# EAGLE schematic ISA Sound Card (EAGLE 9.0.1)

## Sheet 1 of 4: ISA buffers
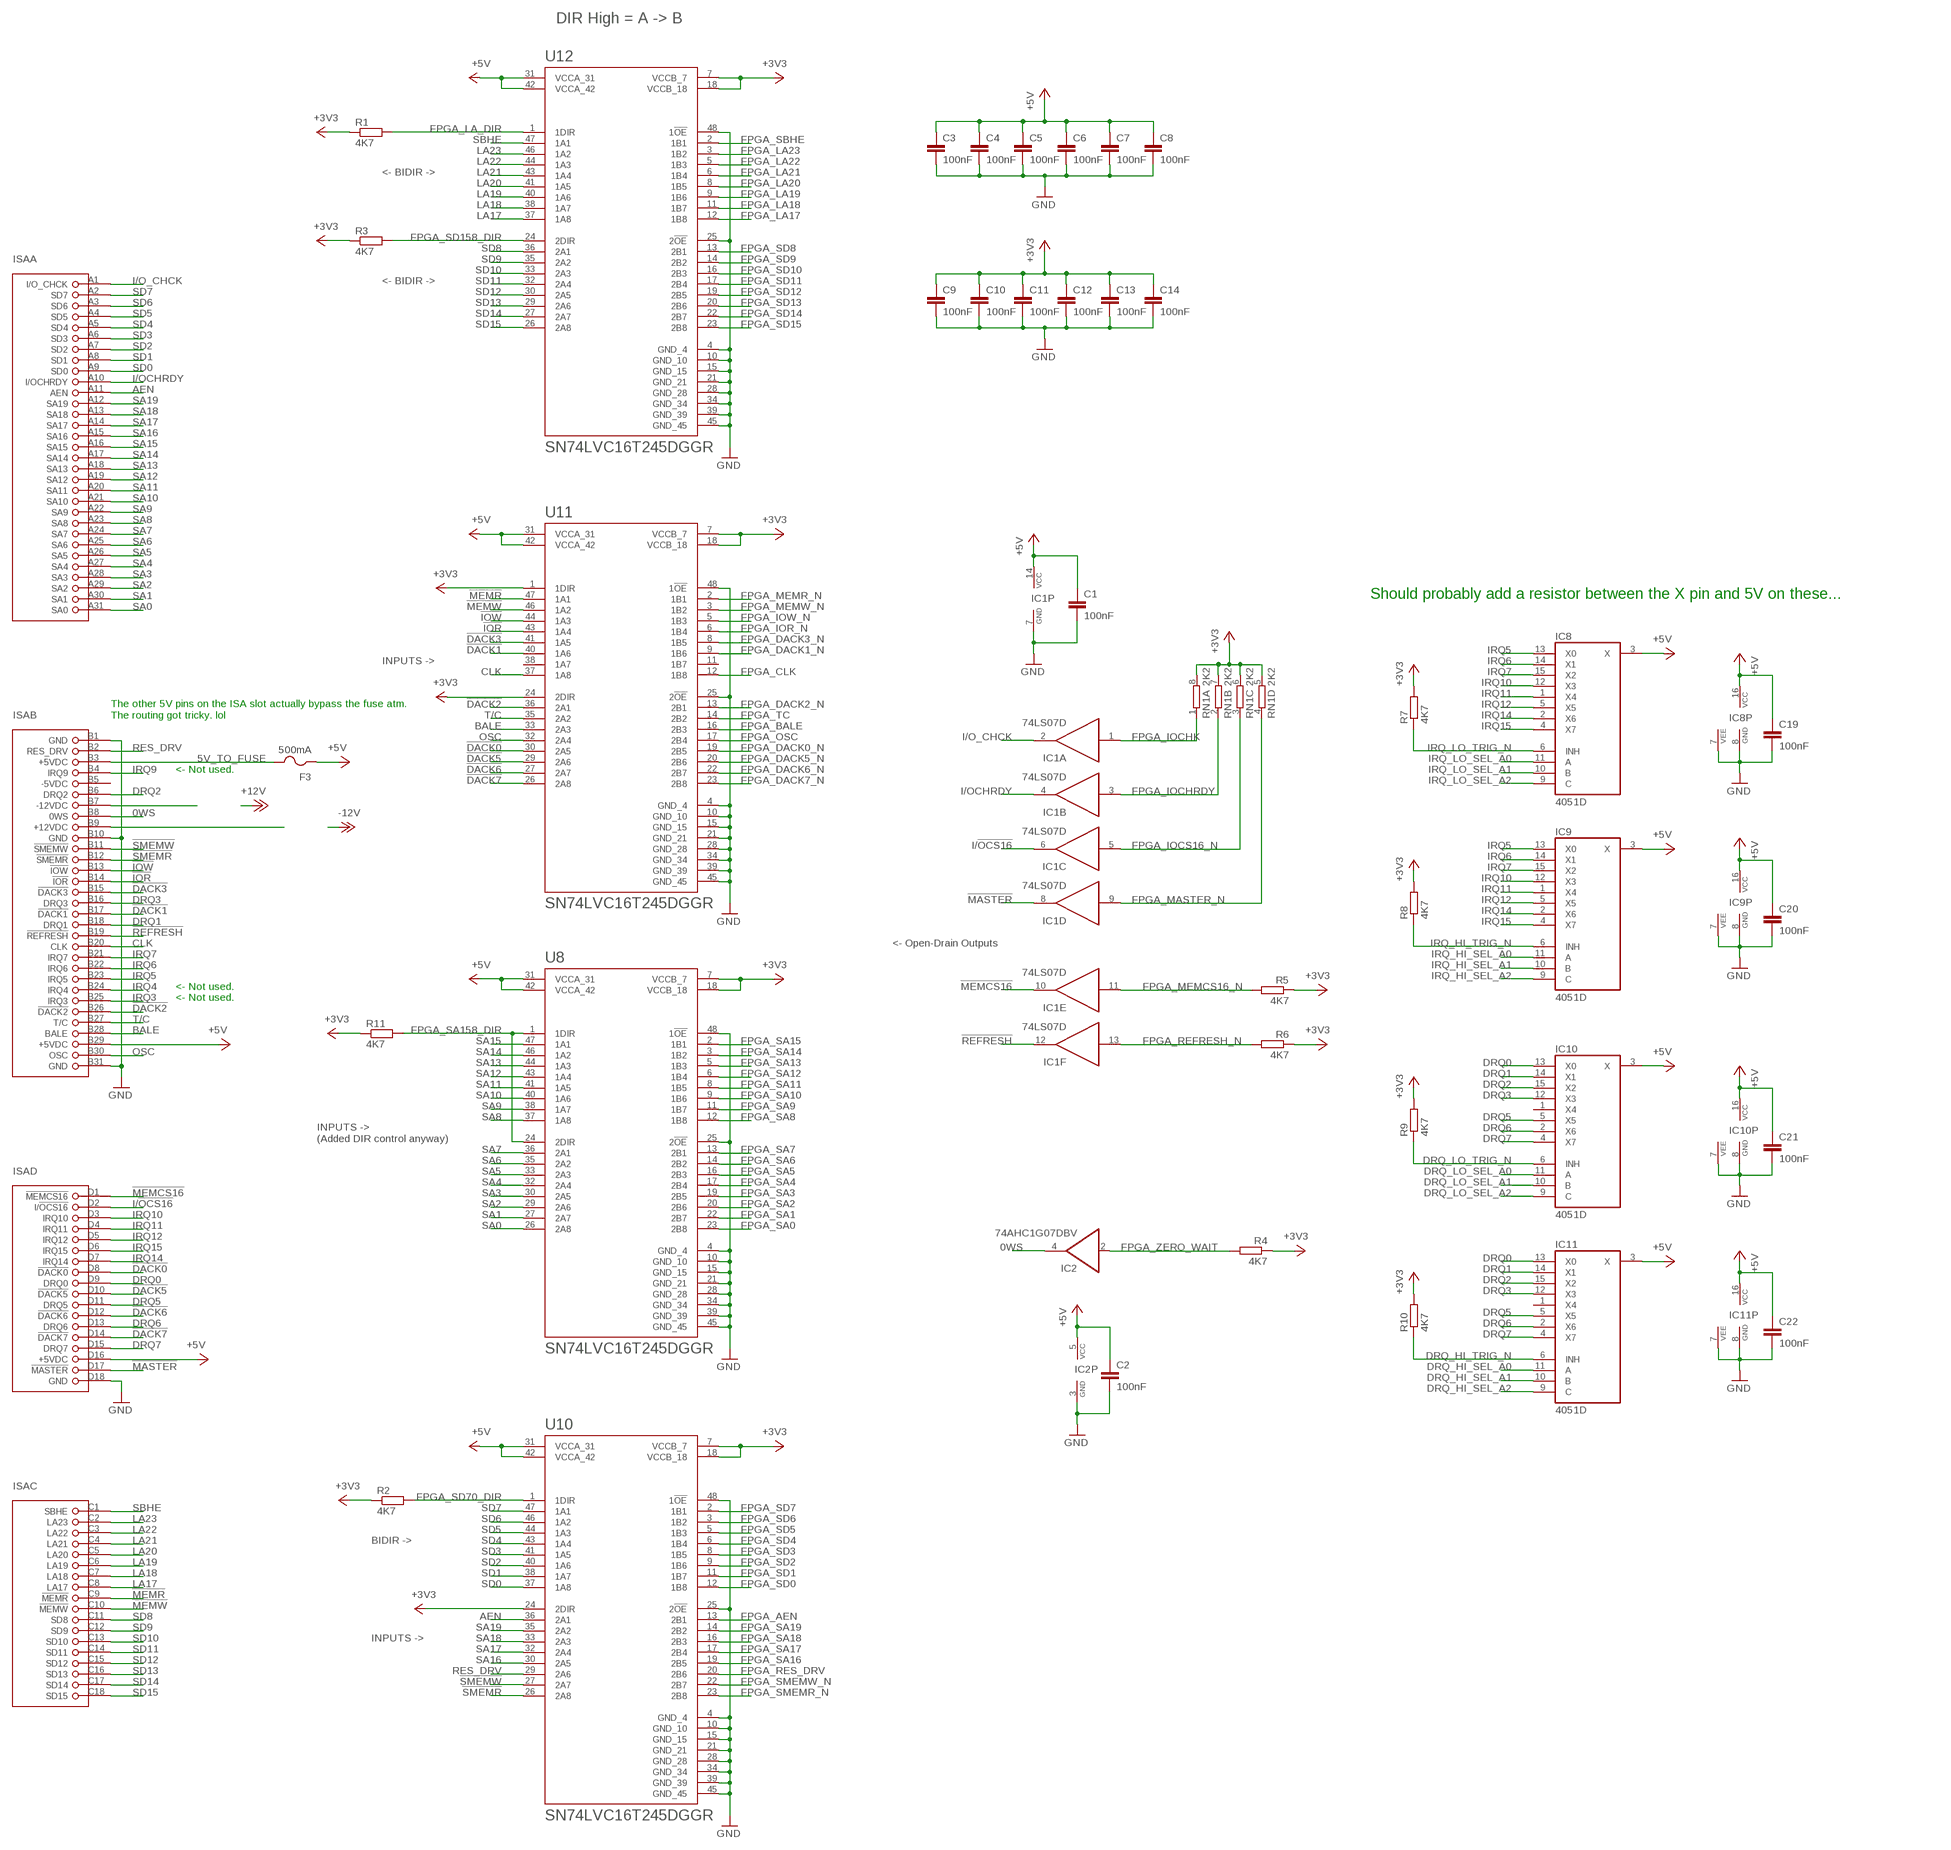
[diagram p0: schematic, sheet 1]

### Parts
C1  100nF  C-EUC0603  [C0603]
C2  100nF  C-EUC0603  [C0603]
C3  100nF  C-EUC0603  [C0603]
C4  100nF  C-EUC0603  [C0603]
C5  100nF  C-EUC0603  [C0603]
C6  100nF  C-EUC0603  [C0603]
C7  100nF  C-EUC0603  [C0603]
C8  100nF  C-EUC0603  [C0603]
C9  100nF  C-EUC0603  [C0603]
C10  100nF  C-EUC0603  [C0603]
C11  100nF  C-EUC0603  [C0603]
C12  100nF  C-EUC0603  [C0603]
C13  100nF  C-EUC0603  [C0603]
C14  100nF  C-EUC0603  [C0603]
C19  100nF  C-EUC0603  [C0603]
C20  100nF  C-EUC0603  [C0603]
C21  100nF  C-EUC0603  [C0603]
C22  100nF  C-EUC0603  [C0603]
F3  500mA  PTCFUSE-1206  [R1206]
IC1  74LS07D  [SO14]
IC2  74AHC1G07DBV  [SOT23-5]
IC8  4051D  [SO16]
IC9  4051D  [SO16]
IC10  4051D  [SO16]
IC11  4051D  [SO16]
ISA  IBMATBUS  [IBM-AT]
R1  4K7  R-EU_R0603  [R0603]
R2  4K7  R-EU_R0603  [R0603]
R3  4K7  R-EU_R0603  [R0603]
R4  4K7  R-EU_R0603  [R0603]
R5  4K7  R-EU_R0603  [R0603]
R6  4K7  R-EU_R0603  [R0603]
R7  4K7  R-EU_R0603  [R0603]
R8  4K7  R-EU_R0603  [R0603]
R9  4K7  R-EU_R0603  [R0603]
R10  4K7  R-EU_R0603  [R0603]
R11  4K7  R-EU_R0603  [R0603]
RN1  2K2  4R-N0603-ARC  [0603-ARC]
U8  SN74LVC16T245DGGR  [SOP50P810X120-48N]
U10  SN74LVC16T245DGGR  [SOP50P810X120-48N]
U11  SN74LVC16T245DGGR  [SOP50P810X120-48N]
U12  SN74LVC16T245DGGR  [SOP50P810X120-48N]

### Nets
0WS: IC2.4(O) ISA.B8(B:0WS)
5V_TO_FUSE: F3.2 ISA.B3(B:+5VDC)
!DACK0: ISA.D8(D:!DACK0) U11.30(2A5)
!DACK1: ISA.B17(B:!DACK1) U11.40(1A6)
!DACK2: ISA.B26(B:!DACK2) U11.36(2A1)
!DACK3: ISA.B15(B:!DACK3) U11.41(1A5)
!DACK5: ISA.D10(D:!DACK5) U11.29(2A6)
!DACK6: ISA.D12(D:!DACK6) U11.27(2A7)
!DACK7: ISA.D14(D:!DACK7) U11.26(2A8)
!IOR: ISA.B14(B:!IOR) U11.43(1A4)
!IOW: ISA.B13(B:!IOW) U11.44(1A3)
!MASTER: IC1.8(D:O) ISA.D17(D:!MASTER)
!MEMCS16: IC1.10(E:O) ISA.D1(D:!MEMCS16)
!MEMR: ISA.C9(C:!MEMR) U11.47(1A1)
!MEMW: ISA.C10(C:!MEMW) U11.46(1A2)
!REFRESH: IC1.12(F:O) ISA.B19(B:!REFRESH)
!SMEMR: ISA.B12(B:!SMEMR) U10.26(2A8)
!SMEMW: ISA.B11(B:!SMEMW) U10.27(2A7)
+3V3: C9.1 C10.1 C11.1 C12.1 C13.1 C14.1 R1.1 R2.1 R3.1 R4.1 R5.1 R6.1 R7.2 R8.2 R9.2 R10.2 R11.1 RN1.5 RN1.6 RN1.7 RN1.8 U8.7(VCCB_7) U8.18(VCCB_18) U10.7(VCCB_7) U10.18(VCCB_18) U10.24(2DIR) U11.1(1DIR) U11.7(VCCB_7) U11.18(VCCB_18) U11.24(2DIR) U12.7(VCCB_7) U12.18(VCCB_18) ; also sheet 2,4
+5V: C1.1 C2.1 C3.1 C4.1 C5.1 C6.1 C7.1 C8.1 C19.1 C20.1 C21.1 C22.1 F3.1 IC1.14(P:VCC) IC2.5(VCC) IC8.3(X) IC8.16(VCC) IC9.3(X) IC9.16(VCC) IC10.3(X) IC10.16(VCC) IC11.3(X) IC11.16(VCC) ISA.B29(B:+5VDC) ISA.D16(D:+5VDC) U8.31(VCCA_31) U8.42(VCCA_42) U10.31(VCCA_31) U10.42(VCCA_42) U11.31(VCCA_31) U11.42(VCCA_42) U12.31(VCCA_31) U12.42(VCCA_42) ; also sheet 2,3,4
AEN: ISA.A11(A:AEN) U10.36(2A1)
BALE: ISA.B28(B:BALE) U11.33(2A3)
CLK: ISA.B20(B:CLK) U11.37(1A8)
DRQ0: IC10.13(X0) IC11.13(X0) ISA.D9(D:DRQ0)
DRQ1: IC10.14(X1) IC11.14(X1) ISA.B18(B:DRQ1)
DRQ2: IC10.15(X2) IC11.15(X2) ISA.B6(B:DRQ2)
DRQ3: IC10.12(X3) IC11.12(X3) ISA.B16(B:DRQ3)
DRQ5: IC10.5(X5) IC11.5(X5) ISA.D11(D:DRQ5)
DRQ6: IC10.2(X6) IC11.2(X6) ISA.D13(D:DRQ6)
DRQ7: IC10.4(X7) IC11.4(X7) ISA.D15(D:DRQ7)
DRQ_HI_SEL_A0: IC11.11(A) ; also sheet 2
DRQ_HI_SEL_A1: IC11.10(B) ; also sheet 2
DRQ_HI_SEL_A2: IC11.9(C) ; also sheet 2
DRQ_HI_TRIG_N: IC11.6(INH) R10.1 ; also sheet 2
DRQ_LO_SEL_A0: IC10.11(A) ; also sheet 2
DRQ_LO_SEL_A1: IC10.10(B) ; also sheet 2
DRQ_LO_SEL_A2: IC10.9(C) ; also sheet 2
DRQ_LO_TRIG_N: IC10.6(INH) R9.1 ; also sheet 2
FPGA_AEN: U10.13(2B1) ; also sheet 2
FPGA_BALE: U11.16(2B3) ; also sheet 2
FPGA_CLK: U11.12(1B8) ; also sheet 2
FPGA_DACK0_N: U11.19(2B5) ; also sheet 2
FPGA_DACK1_N: U11.9(1B6) ; also sheet 2
FPGA_DACK2_N: U11.13(2B1) ; also sheet 2
FPGA_DACK3_N: U11.8(1B5) ; also sheet 2
FPGA_DACK5_N: U11.20(2B6) ; also sheet 2
FPGA_DACK6_N: U11.22(2B7) ; also sheet 2
FPGA_DACK7_N: U11.23(2B8) ; also sheet 2
FPGA_IOCHK: IC1.1(A:I) RN1.1 ; also sheet 2
FPGA_IOCHRDY: IC1.3(B:I) RN1.2 ; also sheet 2
FPGA_IOCS16_N: IC1.5(C:I) RN1.3 ; also sheet 2
FPGA_IOR_N: U11.6(1B4) ; also sheet 2
FPGA_IOW_N: U11.5(1B3) ; also sheet 2
FPGA_LA17: U12.12(1B8) ; also sheet 2
FPGA_LA18: U12.11(1B7) ; also sheet 2
FPGA_LA19: U12.9(1B6) ; also sheet 2
FPGA_LA20: U12.8(1B5) ; also sheet 2
FPGA_LA21: U12.6(1B4) ; also sheet 2
FPGA_LA22: U12.5(1B3) ; also sheet 2
FPGA_LA23: U12.3(1B2) ; also sheet 2
FPGA_LA_DIR: R1.2 U12.1(1DIR) ; also sheet 2
FPGA_MASTER_N: IC1.9(D:I) RN1.4 ; also sheet 2
FPGA_MEMCS16_N: IC1.11(E:I) R5.2 ; also sheet 2
FPGA_MEMR_N: U11.2(1B1) ; also sheet 2
FPGA_MEMW_N: U11.3(1B2) ; also sheet 2
FPGA_OSC: U11.17(2B4) ; also sheet 2
FPGA_REFRESH_N: IC1.13(F:I) R6.2 ; also sheet 2
FPGA_RES_DRV: U10.20(2B6) ; also sheet 2
FPGA_SA0: U8.23(2B8) ; also sheet 2
FPGA_SA1: U8.22(2B7) ; also sheet 2
FPGA_SA2: U8.20(2B6) ; also sheet 2
FPGA_SA3: U8.19(2B5) ; also sheet 2
FPGA_SA4: U8.17(2B4) ; also sheet 2
FPGA_SA5: U8.16(2B3) ; also sheet 2
FPGA_SA6: U8.14(2B2) ; also sheet 2
FPGA_SA7: U8.13(2B1) ; also sheet 2
FPGA_SA8: U8.12(1B8) ; also sheet 2
FPGA_SA9: U8.11(1B7) ; also sheet 2
FPGA_SA10: U8.9(1B6) ; also sheet 2
FPGA_SA11: U8.8(1B5) ; also sheet 2
FPGA_SA12: U8.6(1B4) ; also sheet 2
FPGA_SA13: U8.5(1B3) ; also sheet 2
FPGA_SA14: U8.3(1B2) ; also sheet 2
FPGA_SA15: U8.2(1B1) ; also sheet 2
FPGA_SA16: U10.19(2B5) ; also sheet 2
FPGA_SA17: U10.17(2B4) ; also sheet 2
FPGA_SA18: U10.16(2B3) ; also sheet 2
FPGA_SA19: U10.14(2B2) ; also sheet 2
FPGA_SA158_DIR: R11.2 U8.1(1DIR) U8.24(2DIR) ; also sheet 2
FPGA_SBHE: U12.2(1B1) ; also sheet 2
FPGA_SD0: U10.12(1B8) ; also sheet 2
FPGA_SD1: U10.11(1B7) ; also sheet 2
FPGA_SD2: U10.9(1B6) ; also sheet 2
FPGA_SD3: U10.8(1B5) ; also sheet 2
FPGA_SD4: U10.6(1B4) ; also sheet 2
FPGA_SD5: U10.5(1B3) ; also sheet 2
FPGA_SD6: U10.3(1B2) ; also sheet 2
FPGA_SD7: U10.2(1B1) ; also sheet 2
FPGA_SD8: U12.13(2B1) ; also sheet 2
FPGA_SD9: U12.14(2B2) ; also sheet 2
FPGA_SD10: U12.16(2B3) ; also sheet 2
FPGA_SD11: U12.17(2B4) ; also sheet 2
FPGA_SD12: U12.19(2B5) ; also sheet 2
FPGA_SD13: U12.20(2B6) ; also sheet 2
FPGA_SD14: U12.22(2B7) ; also sheet 2
FPGA_SD15: U12.23(2B8) ; also sheet 2
FPGA_SD70_DIR: R2.2 U10.1(1DIR) ; also sheet 2
FPGA_SD158_DIR: R3.2 U12.24(2DIR) ; also sheet 2
FPGA_SMEMR_N: U10.23(2B8) ; also sheet 2
FPGA_SMEMW_N: U10.22(2B7) ; also sheet 2
FPGA_TC: U11.14(2B2) ; also sheet 2
FPGA_ZERO_WAIT: IC2.2(I) R4.2 ; also sheet 2
GND: C1.2 C2.2 C3.2 C4.2 C5.2 C6.2 C7.2 C8.2 C9.2 C10.2 C11.2 C12.2 C13.2 C14.2 C19.2 C20.2 C21.2 C22.2 IC1.7(P:GND) IC2.3(GND) IC8.7(VEE) IC8.8(GND) IC9.7(VEE) IC9.8(GND) IC10.7(VEE) IC10.8(GND) IC11.7(VEE) IC11.8(GND) ISA.B1(B:GND) ISA.B10(B:GND) ISA.B31(B:GND) ISA.D18(D:GND) U8.4(GND_4) U8.10(GND_10) U8.15(GND_15) U8.21(GND_21) U8.25(2!OE) U8.28(GND_28) U8.34(GND_34) U8.39(GND_39) U8.45(GND_45) U8.48(1!OE) U10.4(GND_4) U10.10(GND_10) U10.15(GND_15) U10.21(GND_21) U10.25(2!OE) U10.28(GND_28) U10.34(GND_34) U10.39(GND_39) U10.45(GND_45) U10.48(1!OE) U11.4(GND_4) U11.10(GND_10) U11.15(GND_15) U11.21(GND_21) U11.25(2!OE) U11.28(GND_28) U11.34(GND_34) U11.39(GND_39) U11.45(GND_45) U11.48(1!OE) U12.4(GND_4) U12.10(GND_10) U12.15(GND_15) U12.21(GND_21) U12.25(2!OE) U12.28(GND_28) U12.34(GND_34) U12.39(GND_39) U12.45(GND_45) U12.48(1!OE) ; also sheet 2,3,4
I/!OCS16: IC1.6(C:O) ISA.D2(D:I/!OCS16)
I/O_CHCK: IC1.2(A:O) ISA.A1(A:I/O_CHCK)
I/OCHRDY: IC1.4(B:O) ISA.A10(A:I/OCHRDY)
IRQ3: ISA.B25(B:IRQ3)
IRQ4: ISA.B24(B:IRQ4)
IRQ5: IC8.13(X0) IC9.13(X0) ISA.B23(B:IRQ5)
IRQ6: IC8.14(X1) IC9.14(X1) ISA.B22(B:IRQ6)
IRQ7: IC8.15(X2) IC9.15(X2) ISA.B21(B:IRQ7)
IRQ9: ISA.B4(B:IRQ9)
IRQ10: IC8.12(X3) IC9.12(X3) ISA.D3(D:IRQ10)
IRQ11: IC8.1(X4) IC9.1(X4) ISA.D4(D:IRQ11)
IRQ12: IC8.5(X5) IC9.5(X5) ISA.D5(D:IRQ12)
IRQ14: IC8.2(X6) IC9.2(X6) ISA.D7(D:IRQ14)
IRQ15: IC8.4(X7) IC9.4(X7) ISA.D6(D:IRQ15)
IRQ_HI_SEL_A0: IC9.11(A) ; also sheet 2
IRQ_HI_SEL_A1: IC9.10(B) ; also sheet 2
IRQ_HI_SEL_A2: IC9.9(C) ; also sheet 2
IRQ_HI_TRIG_N: IC9.6(INH) R8.1 ; also sheet 2
IRQ_LO_SEL_A0: IC8.11(A) ; also sheet 2
IRQ_LO_SEL_A1: IC8.10(B) ; also sheet 2
IRQ_LO_SEL_A2: IC8.9(C) ; also sheet 2
IRQ_LO_TRIG_N: IC8.6(INH) R7.1 ; also sheet 2
LA17: ISA.C8(C:LA17) U12.37(1A8)
LA18: ISA.C7(C:LA18) U12.38(1A7)
LA19: ISA.C6(C:LA19) U12.40(1A6)
LA20: ISA.C5(C:LA20) U12.41(1A5)
LA21: ISA.C4(C:LA21) U12.43(1A4)
LA22: ISA.C3(C:LA22) U12.44(1A3)
LA23: ISA.C2(C:LA23) U12.46(1A2)
N$14: ISA.B7(B:-12VDC)
N$27: ISA.B9(B:+12VDC)
OSC: ISA.B30(B:OSC) U11.32(2A4)
RES_DRV: ISA.B2(B:RES_DRV) U10.29(2A6)
SA0: ISA.A31(A:SA0) U8.26(2A8)
SA1: ISA.A30(A:SA1) U8.27(2A7)
SA2: ISA.A29(A:SA2) U8.29(2A6)
SA3: ISA.A28(A:SA3) U8.30(2A5)
SA4: ISA.A27(A:SA4) U8.32(2A4)
SA5: ISA.A26(A:SA5) U8.33(2A3)
SA6: ISA.A25(A:SA6) U8.35(2A2)
SA7: ISA.A24(A:SA7) U8.36(2A1)
SA8: ISA.A23(A:SA8) U8.37(1A8)
SA9: ISA.A22(A:SA9) U8.38(1A7)
SA10: ISA.A21(A:SA10) U8.40(1A6)
SA11: ISA.A20(A:SA11) U8.41(1A5)
SA12: ISA.A19(A:SA12) U8.43(1A4)
SA13: ISA.A18(A:SA13) U8.44(1A3)
SA14: ISA.A17(A:SA14) U8.46(1A2)
SA15: ISA.A16(A:SA15) U8.47(1A1)
SA16: ISA.A15(A:SA16) U10.30(2A5)
SA17: ISA.A14(A:SA17) U10.32(2A4)
SA18: ISA.A13(A:SA18) U10.33(2A3)
SA19: ISA.A12(A:SA19) U10.35(2A2)
SBHE: ISA.C1(C:SBHE) U12.47(1A1)
SD0: ISA.A9(A:SD0) U10.37(1A8)
SD1: ISA.A8(A:SD1) U10.38(1A7)
SD2: ISA.A7(A:SD2) U10.40(1A6)
SD3: ISA.A6(A:SD3) U10.41(1A5)
SD4: ISA.A5(A:SD4) U10.43(1A4)
SD5: ISA.A4(A:SD5) U10.44(1A3)
SD6: ISA.A3(A:SD6) U10.46(1A2)
SD7: ISA.A2(A:SD7) U10.47(1A1)
SD8: ISA.C11(C:SD8) U12.36(2A1)
SD9: ISA.C12(C:SD9) U12.35(2A2)
SD10: ISA.C13(C:SD10) U12.33(2A3)
SD11: ISA.C14(C:SD11) U12.32(2A4)
SD12: ISA.C15(C:SD12) U12.30(2A5)
SD13: ISA.C16(C:SD13) U12.29(2A6)
SD14: ISA.C17(C:SD14) U12.27(2A7)
SD15: ISA.C18(C:SD15) U12.26(2A8)
T/C: ISA.B27(B:T/C) U11.35(2A2)
Unconnected: IC10.1(X4) IC11.1(X4) U11.11(1B7) U11.38(1A7)

### Notes on the sheet
- DIR High = A -> B
- <- BIDIR ->
- <- BIDIR ->
- Should probably add a resistor between the X pin and 5V on these...
- INPUTS ->
- The other 5V pins on the ISA slot actually bypass the fuse atm.
  The routing got tricky. lol
- <- Not used.
- <- Open-Drain Outputs
- <- Not used.
- <- Not used.
- INPUTS ->
  (Added DIR control anyway)
- BIDIR ->
- INPUTS ->

## Sheet 2 of 4: FPGA
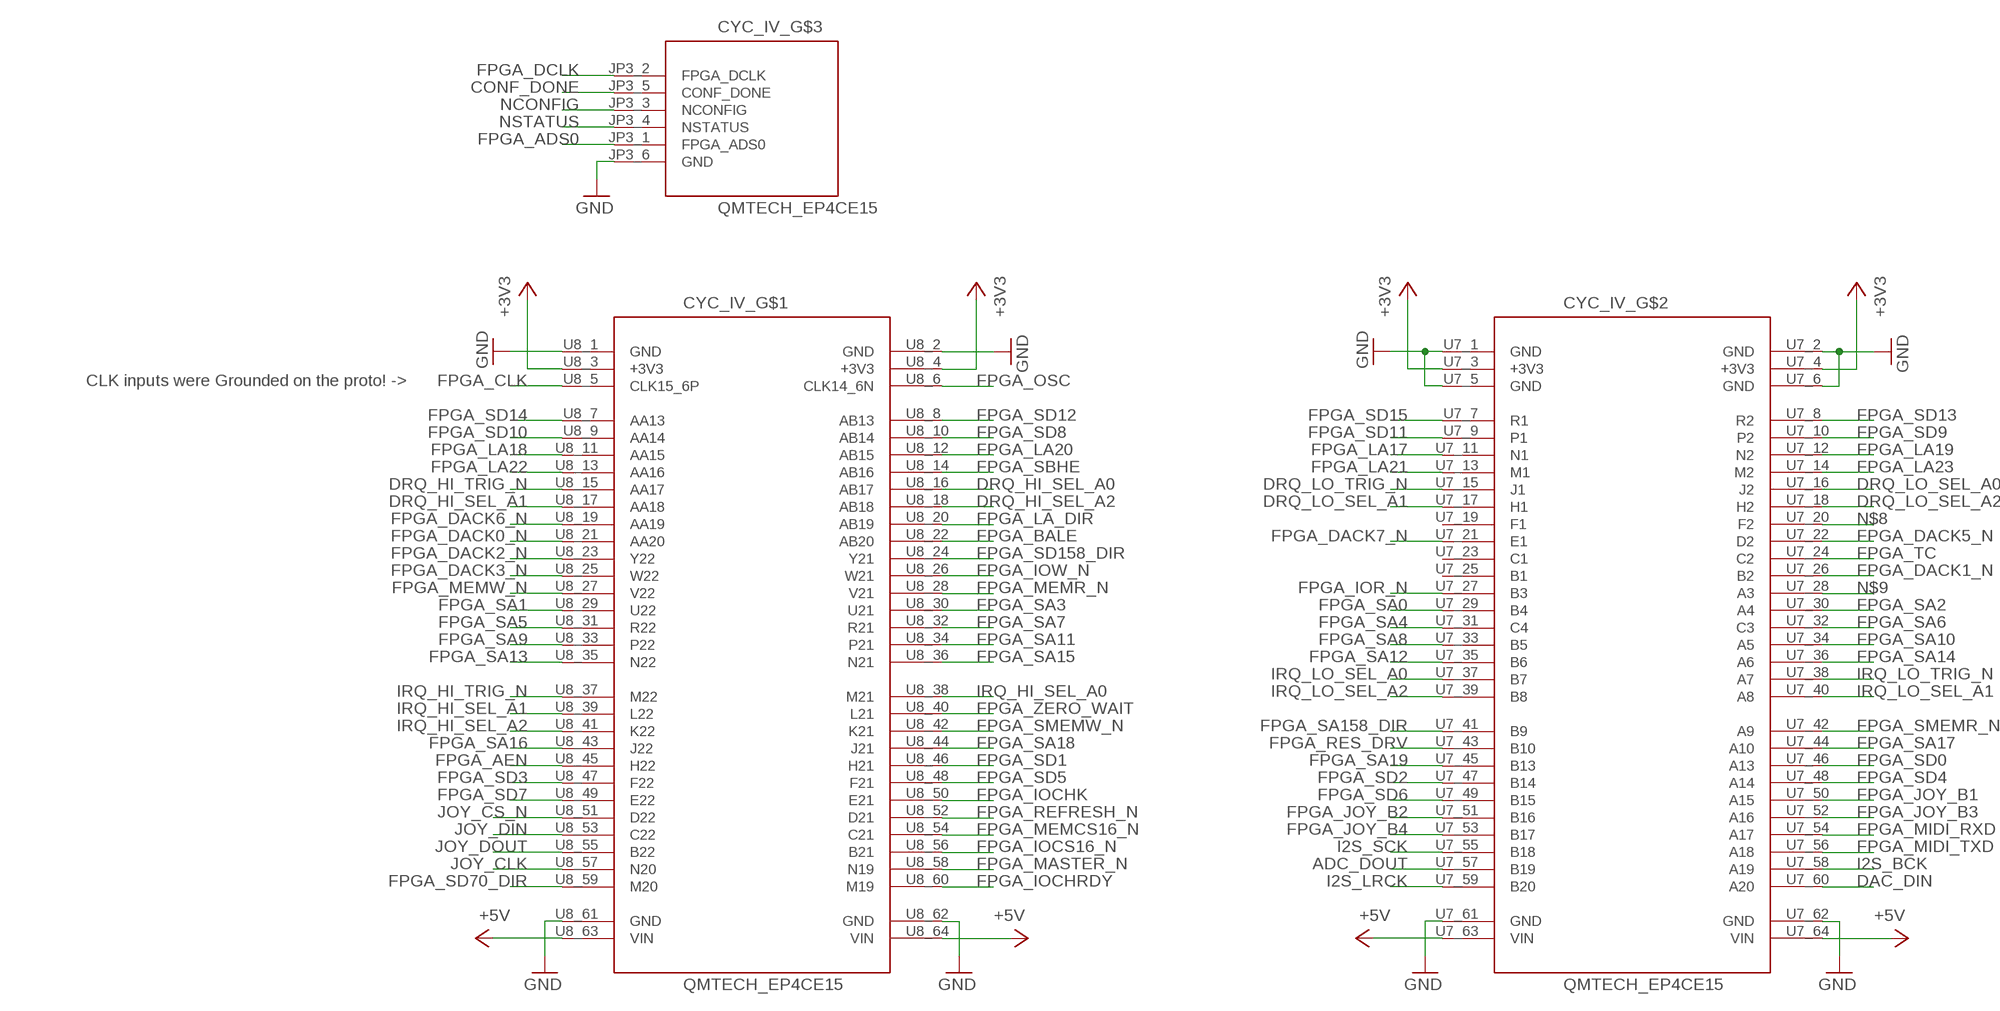
[diagram p1: schematic, sheet 2]

### Parts
CYC_IV_  QMTECH_EP4CE15  [QMTECH_EP4CE15_SMD]

### Nets
+3V3: CYC_IV_.U7_3(+3V3) CYC_IV_.U7_4(+3V3) CYC_IV_.U8_3(+3V3) CYC_IV_.U8_4(+3V3) ; also sheet 1,4
+5V: CYC_IV_.U7_63(VIN) CYC_IV_.U7_64(VIN) CYC_IV_.U8_63(VIN) CYC_IV_.U8_64(VIN) ; also sheet 1,3,4
ADC_DOUT: CYC_IV_.U7_57(B19) ; also sheet 3
CONF_DONE: CYC_IV_.JP3_5(CONF_DONE)
DAC_DIN: CYC_IV_.U7_60(A20) ; also sheet 3
DRQ_HI_SEL_A0: CYC_IV_.U8_16(AB17) ; also sheet 1
DRQ_HI_SEL_A1: CYC_IV_.U8_17(AA18) ; also sheet 1
DRQ_HI_SEL_A2: CYC_IV_.U8_18(AB18) ; also sheet 1
DRQ_HI_TRIG_N: CYC_IV_.U8_15(AA17) ; also sheet 1
DRQ_LO_SEL_A0: CYC_IV_.U7_16(J2) ; also sheet 1
DRQ_LO_SEL_A1: CYC_IV_.U7_17(H1) ; also sheet 1
DRQ_LO_SEL_A2: CYC_IV_.U7_18(H2) ; also sheet 1
DRQ_LO_TRIG_N: CYC_IV_.U7_15(J1) ; also sheet 1
FPGA_ADS0: CYC_IV_.JP3_1(FPGA_ADS0)
FPGA_AEN: CYC_IV_.U8_45(H22) ; also sheet 1
FPGA_BALE: CYC_IV_.U8_22(AB20) ; also sheet 1
FPGA_CLK: CYC_IV_.U8_5(CLK15_6P) ; also sheet 1
FPGA_DACK0_N: CYC_IV_.U8_21(AA20) ; also sheet 1
FPGA_DACK1_N: CYC_IV_.U7_26(B2) ; also sheet 1
FPGA_DACK2_N: CYC_IV_.U8_23(Y22) ; also sheet 1
FPGA_DACK3_N: CYC_IV_.U8_25(W22) ; also sheet 1
FPGA_DACK5_N: CYC_IV_.U7_22(D2) ; also sheet 1
FPGA_DACK6_N: CYC_IV_.U8_19(AA19) ; also sheet 1
FPGA_DACK7_N: CYC_IV_.U7_21(E1) ; also sheet 1
FPGA_DCLK: CYC_IV_.JP3_2(FPGA_DCLK)
FPGA_IOCHK: CYC_IV_.U8_50(E21) ; also sheet 1
FPGA_IOCHRDY: CYC_IV_.U8_60(M19) ; also sheet 1
FPGA_IOCS16_N: CYC_IV_.U8_56(B21) ; also sheet 1
FPGA_IOR_N: CYC_IV_.U7_27(B3) ; also sheet 1
FPGA_IOW_N: CYC_IV_.U8_26(W21) ; also sheet 1
FPGA_JOY_B1: CYC_IV_.U7_50(A15) ; also sheet 4
FPGA_JOY_B2: CYC_IV_.U7_51(B16) ; also sheet 4
FPGA_JOY_B3: CYC_IV_.U7_52(A16) ; also sheet 4
FPGA_JOY_B4: CYC_IV_.U7_53(B17) ; also sheet 4
FPGA_LA17: CYC_IV_.U7_11(N1) ; also sheet 1
FPGA_LA18: CYC_IV_.U8_11(AA15) ; also sheet 1
FPGA_LA19: CYC_IV_.U7_12(N2) ; also sheet 1
FPGA_LA20: CYC_IV_.U8_12(AB15) ; also sheet 1
FPGA_LA21: CYC_IV_.U7_13(M1) ; also sheet 1
FPGA_LA22: CYC_IV_.U8_13(AA16) ; also sheet 1
FPGA_LA23: CYC_IV_.U7_14(M2) ; also sheet 1
FPGA_LA_DIR: CYC_IV_.U8_20(AB19) ; also sheet 1
FPGA_MASTER_N: CYC_IV_.U8_58(N19) ; also sheet 1
FPGA_MEMCS16_N: CYC_IV_.U8_54(C21) ; also sheet 1
FPGA_MEMR_N: CYC_IV_.U8_28(V21) ; also sheet 1
FPGA_MEMW_N: CYC_IV_.U8_27(V22) ; also sheet 1
FPGA_MIDI_RXD: CYC_IV_.U7_54(A17) ; also sheet 4
FPGA_MIDI_TXD: CYC_IV_.U7_56(A18) ; also sheet 4
FPGA_OSC: CYC_IV_.U8_6(CLK14_6N) ; also sheet 1
FPGA_REFRESH_N: CYC_IV_.U8_52(D21) ; also sheet 1
FPGA_RES_DRV: CYC_IV_.U7_43(B10) ; also sheet 1
FPGA_SA0: CYC_IV_.U7_29(B4) ; also sheet 1
FPGA_SA1: CYC_IV_.U8_29(U22) ; also sheet 1
FPGA_SA2: CYC_IV_.U7_30(A4) ; also sheet 1
FPGA_SA3: CYC_IV_.U8_30(U21) ; also sheet 1
FPGA_SA4: CYC_IV_.U7_31(C4) ; also sheet 1
FPGA_SA5: CYC_IV_.U8_31(R22) ; also sheet 1
FPGA_SA6: CYC_IV_.U7_32(C3) ; also sheet 1
FPGA_SA7: CYC_IV_.U8_32(R21) ; also sheet 1
FPGA_SA8: CYC_IV_.U7_33(B5) ; also sheet 1
FPGA_SA9: CYC_IV_.U8_33(P22) ; also sheet 1
FPGA_SA10: CYC_IV_.U7_34(A5) ; also sheet 1
FPGA_SA11: CYC_IV_.U8_34(P21) ; also sheet 1
FPGA_SA12: CYC_IV_.U7_35(B6) ; also sheet 1
FPGA_SA13: CYC_IV_.U8_35(N22) ; also sheet 1
FPGA_SA14: CYC_IV_.U7_36(A6) ; also sheet 1
FPGA_SA15: CYC_IV_.U8_36(N21) ; also sheet 1
FPGA_SA16: CYC_IV_.U8_43(J22) ; also sheet 1
FPGA_SA17: CYC_IV_.U7_44(A10) ; also sheet 1
FPGA_SA18: CYC_IV_.U8_44(J21) ; also sheet 1
FPGA_SA19: CYC_IV_.U7_45(B13) ; also sheet 1
FPGA_SA158_DIR: CYC_IV_.U7_41(B9) ; also sheet 1
FPGA_SBHE: CYC_IV_.U8_14(AB16) ; also sheet 1
FPGA_SD0: CYC_IV_.U7_46(A13) ; also sheet 1
FPGA_SD1: CYC_IV_.U8_46(H21) ; also sheet 1
FPGA_SD2: CYC_IV_.U7_47(B14) ; also sheet 1
FPGA_SD3: CYC_IV_.U8_47(F22) ; also sheet 1
FPGA_SD4: CYC_IV_.U7_48(A14) ; also sheet 1
FPGA_SD5: CYC_IV_.U8_48(F21) ; also sheet 1
FPGA_SD6: CYC_IV_.U7_49(B15) ; also sheet 1
FPGA_SD7: CYC_IV_.U8_49(E22) ; also sheet 1
FPGA_SD8: CYC_IV_.U8_10(AB14) ; also sheet 1
FPGA_SD9: CYC_IV_.U7_10(P2) ; also sheet 1
FPGA_SD10: CYC_IV_.U8_9(AA14) ; also sheet 1
FPGA_SD11: CYC_IV_.U7_9(P1) ; also sheet 1
FPGA_SD12: CYC_IV_.U8_8(AB13) ; also sheet 1
FPGA_SD13: CYC_IV_.U7_8(R2) ; also sheet 1
FPGA_SD14: CYC_IV_.U8_7(AA13) ; also sheet 1
FPGA_SD15: CYC_IV_.U7_7(R1) ; also sheet 1
FPGA_SD70_DIR: CYC_IV_.U8_59(M20) ; also sheet 1
FPGA_SD158_DIR: CYC_IV_.U8_24(Y21) ; also sheet 1
FPGA_SMEMR_N: CYC_IV_.U7_42(A9) ; also sheet 1
FPGA_SMEMW_N: CYC_IV_.U8_42(K21) ; also sheet 1
FPGA_TC: CYC_IV_.U7_24(C2) ; also sheet 1
FPGA_ZERO_WAIT: CYC_IV_.U8_40(L21) ; also sheet 1
GND: CYC_IV_.JP3_6(GND) CYC_IV_.U7_1(GND) CYC_IV_.U7_2(GND) CYC_IV_.U7_5(GND) CYC_IV_.U7_6(GND) CYC_IV_.U7_61(GND) CYC_IV_.U7_62(GND) CYC_IV_.U8_1(GND) CYC_IV_.U8_2(GND) CYC_IV_.U8_61(GND) CYC_IV_.U8_62(GND) ; also sheet 1,3,4
I2S_BCK: CYC_IV_.U7_58(A19) ; also sheet 3
I2S_LRCK: CYC_IV_.U7_59(B20) ; also sheet 3
I2S_SCK: CYC_IV_.U7_55(B18) ; also sheet 3
IRQ_HI_SEL_A0: CYC_IV_.U8_38(M21) ; also sheet 1
IRQ_HI_SEL_A1: CYC_IV_.U8_39(L22) ; also sheet 1
IRQ_HI_SEL_A2: CYC_IV_.U8_41(K22) ; also sheet 1
IRQ_HI_TRIG_N: CYC_IV_.U8_37(M22) ; also sheet 1
IRQ_LO_SEL_A0: CYC_IV_.U7_37(B7) ; also sheet 1
IRQ_LO_SEL_A1: CYC_IV_.U7_40(A8) ; also sheet 1
IRQ_LO_SEL_A2: CYC_IV_.U7_39(B8) ; also sheet 1
IRQ_LO_TRIG_N: CYC_IV_.U7_38(A7) ; also sheet 1
JOY_CLK: CYC_IV_.U8_57(N20) ; also sheet 4
JOY_CS_N: CYC_IV_.U8_51(D22) ; also sheet 4
JOY_DIN: CYC_IV_.U8_53(C22) ; also sheet 4
JOY_DOUT: CYC_IV_.U8_55(B22) ; also sheet 4
N$8: CYC_IV_.U7_20(F2)
N$9: CYC_IV_.U7_28(A3)
NCONFIG: CYC_IV_.JP3_3(NCONFIG)
NSTATUS: CYC_IV_.JP3_4(NSTATUS)
Unconnected: CYC_IV_.U7_19(F1) CYC_IV_.U7_23(C1) CYC_IV_.U7_25(B1)

### Notes on the sheet
- CLK inputs were Grounded on the proto! ->

## Sheet 3 of 4: Audio DAC / ADC
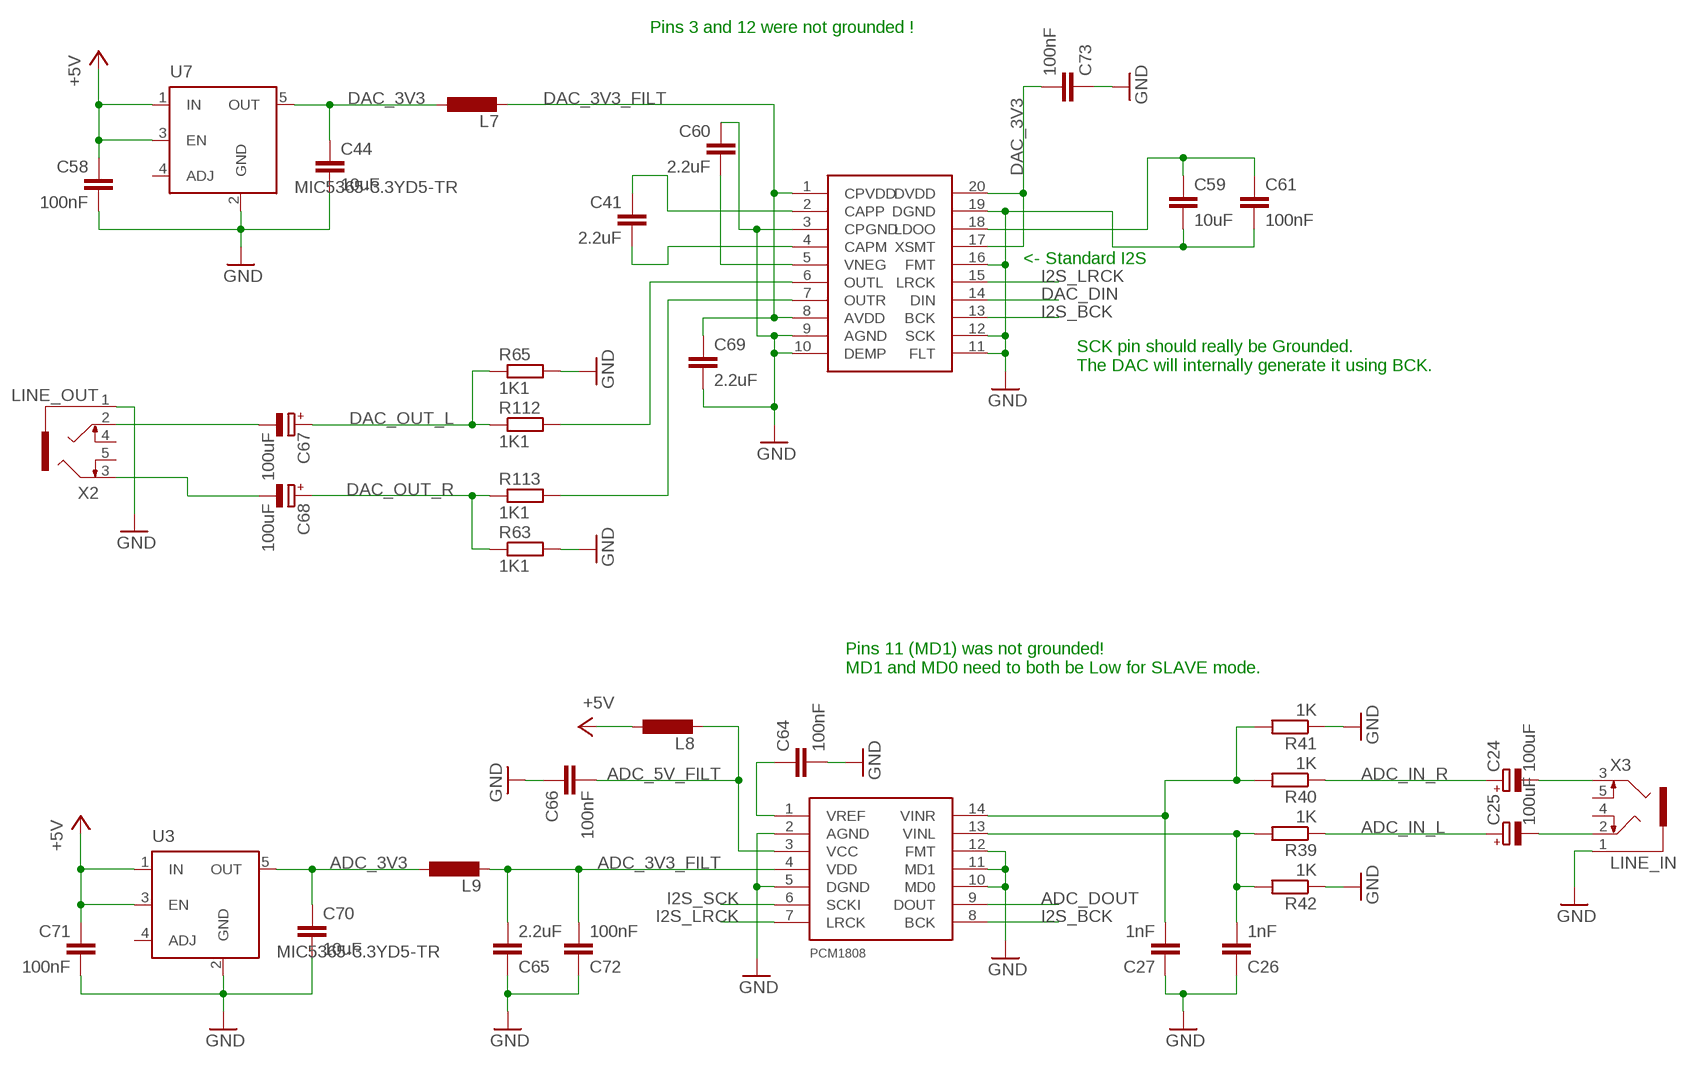
[diagram p2: schematic, sheet 3]

### Parts
C24  100uF  CPOL-EUC  [PANASONIC_C]
C25  100uF  CPOL-EUC  [PANASONIC_C]
C26  1nF  C-EUC0805  [C0805]
C27  1nF  C-EUC0805  [C0805]
C41  2.2uF  C-EUC0603  [C0603]
C44  10uF  C-EUC0603  [C0603]
C58  100nF  C-EUC0603  [C0603]
C59  10uF  C-EUC0603  [C0603]
C60  2.2uF  C-EUC0603  [C0603]
C61  100nF  C-EUC0603  [C0603]
C64  100nF  C-EUC0805  [C0805]
C65  2.2uF  C-EUC0603  [C0603]
C66  100nF  C-EUC0603  [C0603]
C67  100uF  CPOL-EUC  [PANASONIC_C]
C68  100uF  CPOL-EUC  [PANASONIC_C]
C69  2.2uF  C-EUC0603  [C0603]
C70  10uF  C-EUC0603  [C0603]
C71  100nF  C-EUC0603  [C0603]
C72  100nF  C-EUC0603  [C0603]
C73  100nF  C-EUC0603  [C0603]
L7  L-EUL2012C  [L2012C]
L8  L-EUL2012C  [L2012C]
L9  L-EUL2012C  [L2012C]
R39  1K  R-EU_R0603  [R0603]
R40  1K  R-EU_R0603  [R0603]
R41  1K  R-EU_R0603  [R0603]
R42  1K  R-EU_R0603  [R0603]
R63  1K1  R-EU_R0603  [R0603]
R65  1K1  R-EU_R0603  [R0603]
R112  1K1  R-EU_R0603  [R0603]
R113  1K1  R-EU_R0603  [R0603]
U1  PCM1808  [TSSOP14]
U3  MIC5365-3.3YD5-TR  MIC5219BM5  [SOT23-5]
U4  PCM5102  [TSSOP20]
U7  MIC5365-3.3YD5-TR  MIC5219BM5  [SOT23-5]
X2  LINE_OUT  1503_09  [1503_09]
X3  LINE_IN  1503_09  [1503_09]

### Nets
+5V: C58.1 C71.1 L8.1 U3.1(IN) U3.3(EN) U7.1(IN) U7.3(EN) ; also sheet 1,2,4
ADC_3V3: C70.1 L9.1 U3.5(OUT)
ADC_3V3_FILT: C65.2 C72.2 L9.2 U1.4(VDD)
ADC_5V_FILT: C66.2 L8.2 U1.3(VCC)
ADC_DOUT: U1.9(DOUT) ; also sheet 2
ADC_IN_L: C25.+ R39.1
ADC_IN_R: C24.+ R40.1
DAC_3V3: C44.1 C73.2 L7.1 U4.17(XSMT) U4.20(DVDD) U7.5(OUT)
DAC_3V3_FILT: C69.1 L7.2 U4.1(CPVDD) U4.8(AVDD)
DAC_DIN: U4.14(DIN) ; also sheet 2
DAC_OUT_L: C67.+ R65.1 R112.1
DAC_OUT_R: C68.+ R63.1 R113.1
GND: C26.1 C27.1 C44.2 C58.2 C59.2 C60.1 C61.2 C64.2 C65.1 C66.1 C69.2 C70.2 C71.2 C72.1 C73.1 R41.1 R42.1 R63.2 R65.2 U1.2(AGND) U1.5(DGND) U1.10(MD0) U1.11(MD1) U1.12(FMT) U3.2(GND) U4.3(CPGND) U4.9(AGND) U4.10(DEMP) U4.11(FLT) U4.12(SCK) U4.16(FMT) U4.19(DGND) U7.2(GND) X2.1 X3.1 ; also sheet 1,2,4
I2S_BCK: U1.8(BCK) U4.13(BCK) ; also sheet 2
I2S_LRCK: U1.7(LRCK) U4.15(LRCK) ; also sheet 2
I2S_SCK: U1.6(SCKI) ; also sheet 2
N$1: C24.- X3.3
N$2: C25.- X3.2
N$21: C41.2 U4.4(CAPM)
N$22: R113.2 U4.7(OUTR)
N$23: C26.2 R39.2 R42.2 U1.13(VINL)
N$24: C27.2 R40.2 R41.2 U1.14(VINR)
N$25: C64.1 U1.1(VREF)
N$29: C68.- X2.3
N$30: C67.- X2.2
N$43: R112.2 U4.6(OUTL)
N$62: C59.1 C61.1 U4.18(LDOO)
N$73: C41.1 U4.2(CAPP)
N$76: C60.2 U4.5(VNEG)
Unconnected: U3.4(ADJ) U7.4(ADJ) X2.4 X2.5 X3.4 X3.5

### Notes on the sheet
- Pins 3 and 12 were not grounded !
- <- Standard I2S
- SCK pin should really be Grounded.
  The DAC will internally generate it using BCK.
- Pins 11 (MD1) was not grounded!
  MD1 and MD0 need to both be Low for SLAVE mode.

## Sheet 4 of 4: Joystick ADC / Buffer
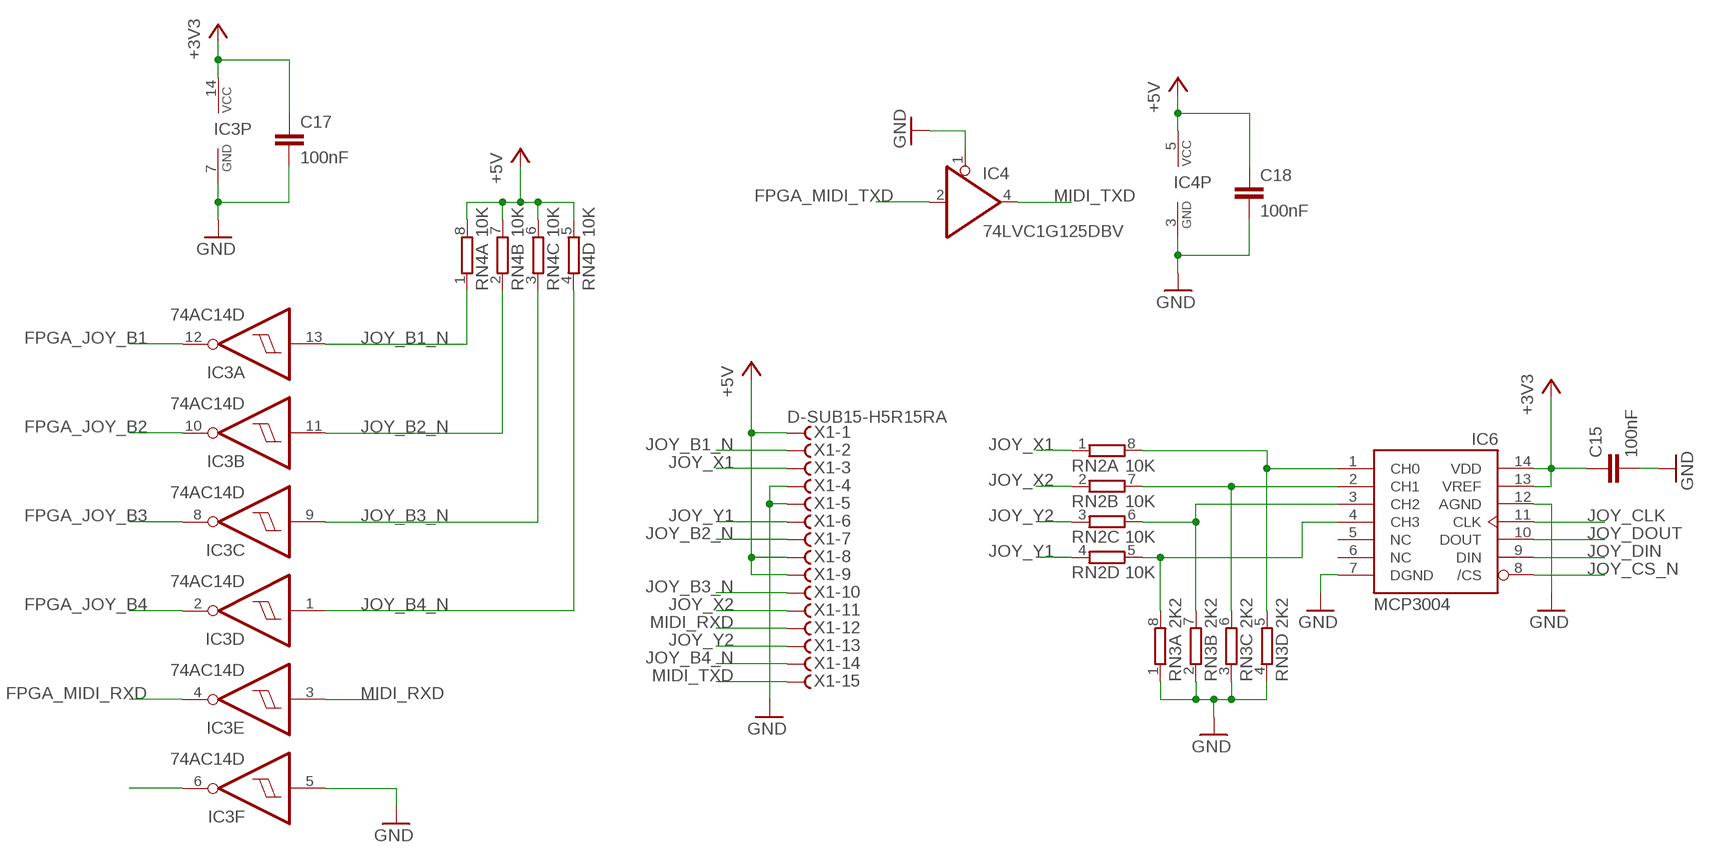
[diagram p3: schematic, sheet 4]

### Parts
C15  100nF  C-EUC0805  [C0805]
C17  100nF  C-EUC0805  [C0805]
C18  100nF  C-EUC0805  [C0805]
IC3  74AC14D  [SO14]
IC4  74LVC1G125DBV  [SOT23-5]
IC6  MCP3004  [SO14]
RN2  10K  4R-N0603-ARC  [0603-ARC]
RN3  2K2  4R-N0603-ARC  [0603-ARC]
RN4  10K  4R-N0603-ARC  [0603-ARC]
X1  D-SUB15-H5R15RA  [H5R15RA]

### Nets
+3V3: C15.1 C17.1 IC3.14(P:VCC) IC6.13(VREF) IC6.14(VDD) ; also sheet 1,2
+5V: C18.1 IC4.5(VCC) RN4.5 RN4.6 RN4.7 RN4.8 X1.1 X1.8 X1.9 ; also sheet 1,2,3
FPGA_JOY_B1: IC3.12(A:O) ; also sheet 2
FPGA_JOY_B2: IC3.10(B:O) ; also sheet 2
FPGA_JOY_B3: IC3.8(C:O) ; also sheet 2
FPGA_JOY_B4: IC3.2(D:O) ; also sheet 2
FPGA_MIDI_RXD: IC3.4(E:O) ; also sheet 2
FPGA_MIDI_TXD: IC4.2(I) ; also sheet 2
GND: C15.2 C17.2 C18.2 IC3.5(F:I) IC3.7(P:GND) IC4.1(OE) IC4.3(GND) IC6.7(DGND) IC6.12(AGND) RN3.1 RN3.2 RN3.3 RN3.4 X1.4 X1.5 ; also sheet 1,2,3
JOY_B1_N: IC3.13(A:I) RN4.1 X1.2
JOY_B2_N: IC3.11(B:I) RN4.2 X1.7
JOY_B3_N: IC3.9(C:I) RN4.3 X1.10
JOY_B4_N: IC3.1(D:I) RN4.4 X1.14
JOY_CLK: IC6.11(CLK) ; also sheet 2
JOY_CS_N: IC6.8(/CS) ; also sheet 2
JOY_DIN: IC6.9(DIN) ; also sheet 2
JOY_DOUT: IC6.10(DOUT) ; also sheet 2
JOY_X1: RN2.1 X1.3
JOY_X2: RN2.2 X1.11
JOY_Y1: RN2.4 X1.6
JOY_Y2: RN2.3 X1.13
MIDI_RXD: IC3.3(E:I) X1.12
MIDI_TXD: IC4.4(O) X1.15
N$15: IC6.4(CH3) RN2.5 RN3.8
N$28: IC6.3(CH2) RN2.6 RN3.7
N$31: IC6.2(CH1) RN2.7 RN3.6
N$32: IC6.1(CH0) RN2.8 RN3.5
N$34: IC3.6(F:O)
Unconnected: IC6.5(NC) IC6.6(NC)

## Power pins joined to a net without a drawn wire
-5VDC: ISA.B5(B:-5VDC)

## Library data of the parts
C1-C15 C17-C22 C26 C27 C41 C44 C58-C61 C64-C66 C69-C73 = rcl:C-EU: CAPACITOR, European symbol
C24 C25 C67 C68 = rcl:CPOL-EU: POLARIZED CAPACITOR, European symbol
CYC_IV_ = qmtech:QMTECH_EP4CE15
F3 = adafruit:PTCFUSE: PTC fuses, resettable thermistors
IC1 = 74xx-eu:74*07: Hex BUFFER, open collector high-voltage output
IC2 = 74xx-little-de:74*1G07: Single Buffer/Driver With Open-Drain Output
IC3 = 74xx-eu:74*14: Hex schmitt trigger INVERTER
IC4 = 74xx-little-de:74*1G125: Single Bus Buffer Gate with 3-State Output
IC6 = adafruit:MCP3004
IC8-IC11 = 40xx:4051: 8-channel ANALOG MULTIPLEXER
ISA = connect:IBMATBUS
L7-L9 = rcl:L-EU: INDUCTOR, European symbol; SPICEPREFIX: L
R1-R11 R39-R42 R63 R65 R112 R113 = rcl:R-EU_: RESISTOR, European symbol
RN1-RN4 = resistor-dil:4R-N: Array Chip Resistor Source: RS Component / Phycomp; OC_FARNELL: unknown; OC_NEWARK: unknown
U1 = pcm1808:PCM1808
U3 U7 = v-reg-micrel:MIC5219BM5: VOLTAGE REGULATOR; MF: ALTERA CORPORATION; MPN: MIC5219BM5 TR; OC_FARNELL: 1100656; OC_NEWARK: 09J8939
U4 = PCM5102:PCM5102
U8 U10-U12 = SN74LVC16T245DGGR:SN74LVC16T245DGGR: 16-bit dual-supply bus transceiver with configurable level-shifting / voltage translation 48-TSSOP -40 to 85 Check availability <https://pricing.snapeda.com/parts/SN74LVC16T245DGGR/Texas%20Instruments/view-part?ref=eda>; AVAILABILITY: In Stock; DESCRIPTION: 16-bit dual-supply bus transceiver with configurable level-shifting / voltage translation; MF: Texas Instruments; MP: SN74LVC16T245DGGR; PACKAGE: TSSOP-48 Texas Instruments; PRICE: None; PURCHASE-URL: https://pricing.snapeda.com/search/part/SN74LVC16T245DGGR/?ref=eda
X1 = con-thomas-betts:D-SUB15-: D-Subminiatur Connector Source: Electronioc Interconnects European Edition 1998; MF: TYCO ELECTRONICS; MPN: H5R15RA29B; OC_FARNELL: unknown; OC_NEWARK: 93F8335
X2 X3 = con-lumberg:1503_09: Jack connectors according to JISC 6560, 3.5 mm Klinkeneinbaukupplung nach JISC 6560, 3,5 mm, 3-polig/ stereo, abgewinkelte Ausführung, mit 2 Öffnern und Lötaugen, für Leiterplatten Rückseitenmontage Source: http://www.lumberg.com/Produkte/PDFs/1503_09.pdf; OC_FARNELL: 1243244; OC_NEWARK: unknown

## Net classes
2 gnd: width 0.152 mm, drill 0.3 mm, clearance 0.203 mm